# Altium project VCO_BFR92.PrjPcb
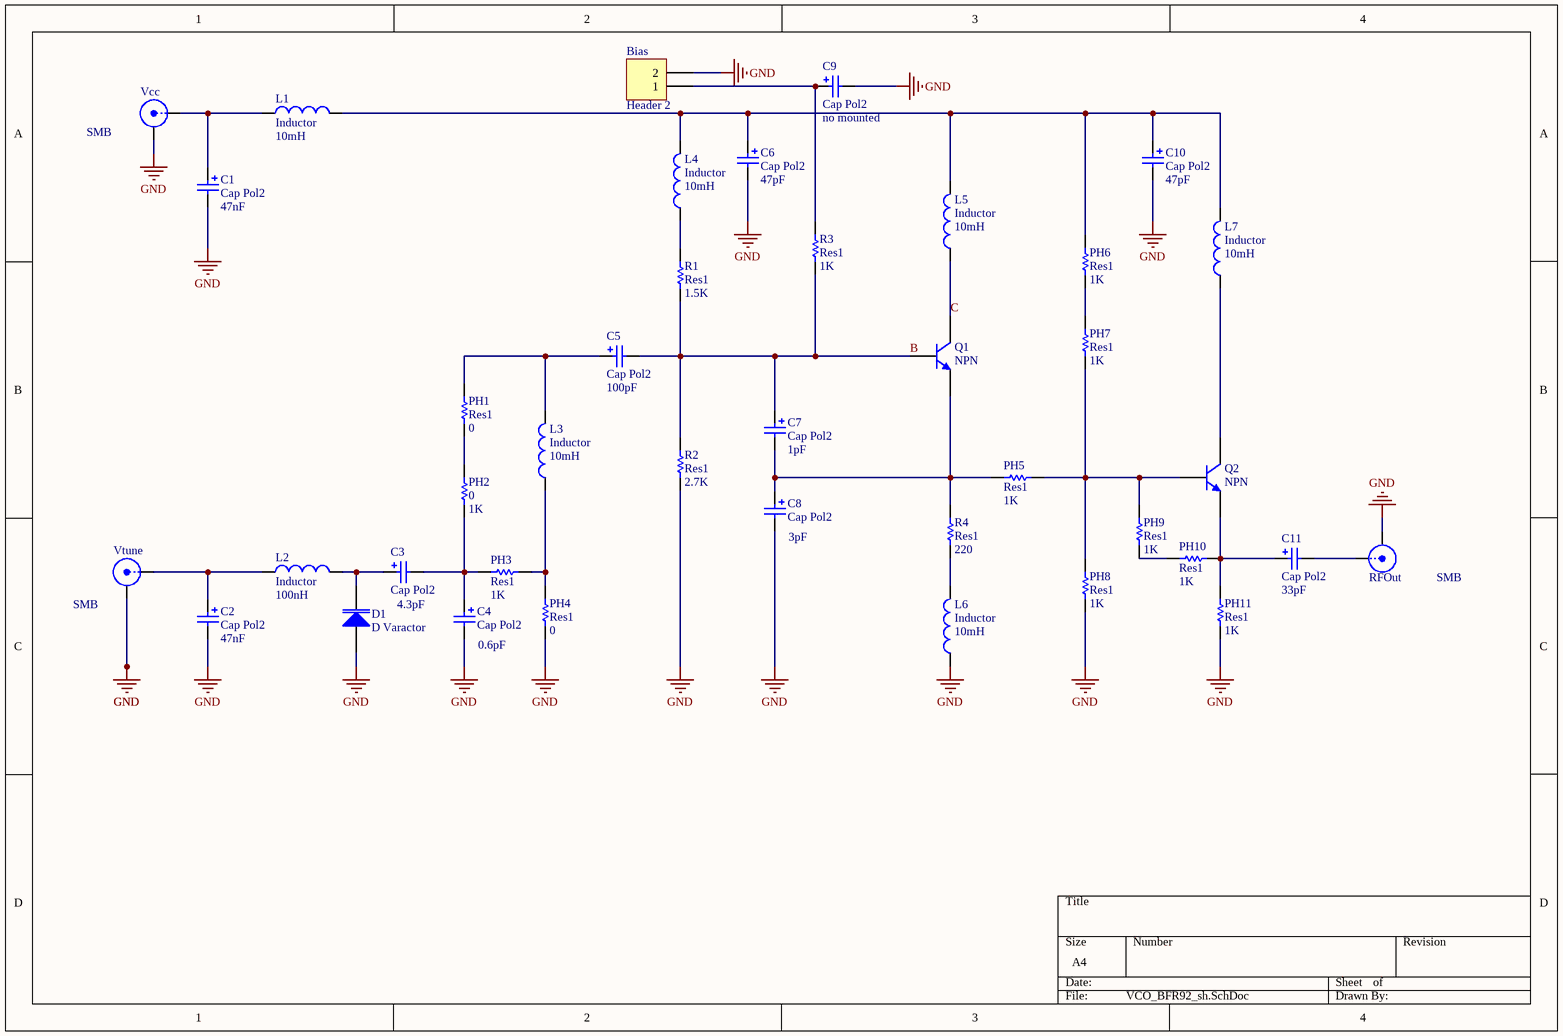
[diagram p0: VCO_BFR92_sh.SchDoc]
1 sheet, 40 parts. Net scope: global (net labels, ports and power ports of the same name join across sheets).
Board file: VCO_BFR92_pcb.PcbDoc

## Sheet VCO_BFR92_sh.SchDoc
size A4; SheetNumber: 1; SheetTotal: 1; SPICEModelCacheUMHTQHEF: <root> / <DocumentId>UMHTQHEF</DocumentId> / <CacheFrame Number="0"> / <Model Name="npn" Kind="MDL"> / <Text>*Default NPN BJT / *NPN Trans Pinout: C,B,E / .MODEL NPN NPN()</Text> / </Model> / <Model Name="bby31" Kind="MDL"> / <Text>*   ZETEX  BBY31  Spice Model        Last revision 18/8/92 / * / .MODEL BBY31 D IS=10.01E-15 N=1.095 RS=.2082 XTI=3 / +      EG=1.11 CJO=27.36E-12 M=1.001 VJ=2.099 FC=.5 BV=45.12 / +      IBV=92.44E-3 TT=145.7E-9</Text> / </Model> / </CacheFrame> / </root>

### Parts
Bias  Header 2  [HDR1X2]
C1  Cap Pol2  value 47nF  [6-0805_N]
C2  Cap Pol2  value 47nF  [6-0805_N]
C3  Cap Pol2  value 4.3pF  [6-0805_N]
C4  Cap Pol2  value 0.6pF  [6-0805_N]
C5  Cap Pol2  value 100pF  [6-0805_N]
C6  Cap Pol2  value 47pF  [6-0805_N]
C7  Cap Pol2  value 1pF  [6-0805_N]
C8  Cap Pol2  value 3pF  [6-0805_N]
C9  Cap Pol2  value no mounted  [6-0805_N]
C10  Cap Pol2  value 47pF  [6-0805_N]
C11  Cap Pol2  value 33pF  [6-0805_N]
D1  D Varactor  [6-0805_N]
L1  Inductor  value 10mH  [6-0805_N]
L2  Inductor  value 100nH  [6-0805_N]
L3  Inductor  value 10mH  [6-0805_N]
L4  Inductor  value 10mH  [6-0805_N]
L5  Inductor  value 10mH  [6-0805_N]
L6  Inductor  value 10mH  [6-0805_N]
L7  Inductor  value 10mH  [6-0805_N]
PH1  Res1  value 0  [6-0805_N]
PH2  0  value 1K  [6-0805_N]
PH3  Res1  value 1K  [6-0805_N]
PH4  Res1  value 0  [6-0805_N]
PH5  Res1  value 1K  [6-0805_N]
PH6  Res1  value 1K  [6-0805_N]
PH7  Res1  value 1K  [6-0805_N]
PH8  Res1  value 1K  [6-0805_N]
PH9  Res1  value 1K  [6-0805_N]
PH10  Res1  value 1K  [6-0805_N]
PH11  Res1  value 1K  [6-0805_N]
Q1  NPN  [SOT23_N]
Q2  NPN  [SOT23_N]
R1  Res1  value 1.5K  [6-0805_N]
R2  Res1  value 2.7K  [6-0805_N]
R3  Res1  value 1K  [6-0805_N]
R4  Res1  value 220  [6-0805_N]
RFOut  SMB  [SMA-142-0701-851]
Vcc  SMB  [SMA-142-0701-851]
Vtune  SMB  [SMA-142-0701-851]

### Nets
GND: Bias.2 C1.2 C2.2 C4.2 C6.2 C8.2 C9.2 C10.2 D1.2(A) L6.1 PH4.1 PH8.1 PH11.2 R2.1 RFOut.2(Y) Vcc.2(Y) Vtune.2(Y)
B: C5.2 C7.1 Q1.3(B) R1.1 R2.2 R3.1
C: L5.1 Q1.1(C)
NetBias_1: Bias.1 C9.1 R3.2
NetC1_1: C1.1 L1.1 Vcc.1(X)
NetC2_1: C2.1 L2.1 Vtune.1(X)
NetC3_1: C3.1 D1.1(K) L2.2
NetC3_2: C3.2 C4.1 PH2.1 PH3.2
NetC5_1: C5.1 L3.2 PH1.2
NetC6_1: C6.1 C10.1 L1.2 L4.2 L5.2 L7.2 PH6.2
NetC7_2: C7.2 C8.1 PH5.2 Q1.2(E) R4.2
NetC11_1: C11.1 PH10.1 PH11.1 Q2.2(E)
NetC11_2: C11.2 RFOut.1(X)
NetL3_1: L3.1 PH3.1 PH4.2
NetL4_1: L4.1 R1.2
NetL6_2: L6.2 R4.1
NetL7_1: L7.1 Q2.1(C)
NetPH1_1: PH1.1 PH2.2
NetPH5_1: PH5.1 PH7.1 PH8.2 PH9.1 Q2.3(B)
NetPH6_1: PH6.1 PH7.2
NetPH9_2: PH9.2 PH10.2

### Library data of the parts
Bias = Header 2: Header, 2-Pin; LatestRevisionDate: 17-Jul-2002; LatestRevisionNote: Re-released for DXP Platform.; Publisher: Altium Limited
C1-C11 = Cap Pol2: Polarized Capacitor (Axial); Published: 8-Jun-2000; LatestRevisionDate: 17-Jul-2002; LatestRevisionNote: Re-released for DXP Platform.; PackageReference: POLAR0.8; Publisher: Altium Limited; PackageDescription: Polarized Capacitor; 2 Leads
D1 = D Varactor: Variable Capacitance Diode; Note: Pin 2 is not connected and not drawn.; Published: 8-Jun-2000; LatestRevisionDate: 29-May-2009; LatestRevisionNote: IPC-7351 Footprint Added.; DatasheetVersion: Jan-1998; PackageVersion: 1996; PackageReference: SOT23A; Publisher: Altium Limited; PackageDescription: 3-Pin SOT-23 Package 0.95 mm Pitch, 2.3 mm Lead Span - Reverse Pinning; ComponentLink1Description: Manufacturer Link; ComponentLink1URL: http://www.zetex.com/
L1-L7 = Inductor: Code_IEC: 1005; Published: 8-Jun-2000; LatestRevisionDate: 29-May-2009; LatestRevisionNote: IPC-7351 Footprint Added.; PackageReference: 0402-A; Publisher: Altium Limited; PackageDescription: Chip Inductor; Code_JEITA: 0402
PH1-PH11 R1-R4 = Res1: Resistor; Published: 8-Jun-2000; LatestRevisionDate: 17-Jul-2002; LatestRevisionNote: Re-released for DXP Platform.; PackageReference: AXIAL-0.3; Publisher: Altium Limited; PackageDescription: Axial Device, Thru-Hole; 2 Leads; 0.3 in Pin Spacing
Q1 Q2 = NPN: NPN Bipolar Transistor; Published: 8-Jun-2000; LatestRevisionDate: 17-Jul-2002; LatestRevisionNote: Re-released for DXP Platform.; PackageReference: TO-226-AA; Publisher: Altium Limited; PackageDescription: TO, Flat Index; 3 In-Line, Axial Leads; Body Dia. 4.8mm; Leads 0.55 x 0.51 mm (max); Code_JEDEC: TO-226-AA
RFOut Vcc Vtune = SMB: SMB Straight Connector; LatestRevisionDate: 17-Jul-2002; LatestRevisionNote: Re-released for DXP Platform.; Publisher: Altium Limited